# Altium schematic sheet Led7segsheet.SchDoc
size A
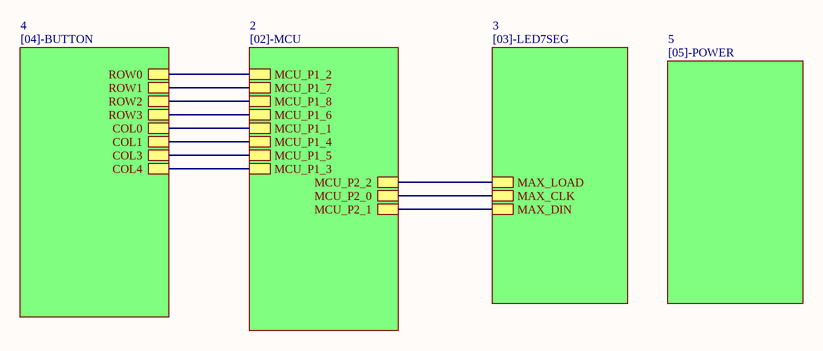
[diagram p0: Led7segsheet.SchDoc]

## Sub-sheets
2 = [02]-MCU: MCU_P2_2, MCU_P2_0, MCU_P2_1, MCU_P1_2, MCU_P1_7, MCU_P1_8, MCU_P1_6, MCU_P1_1, MCU_P1_4, MCU_P1_5, MCU_P1_3
3 = [03]-LED7SEG: MAX_LOAD, MAX_CLK, MAX_DIN
4 = [04]-BUTTON: ROW2, ROW0, COL4, COL1, ROW1, COL0, COL3, ROW3
5 = [05]-POWER: no entries

## Nets
(unnamed): sheet 4/ROW2, sheet 2/MCU_P1_8
(unnamed): sheet 4/ROW0, sheet 2/MCU_P1_2
(unnamed): sheet 4/COL4, sheet 2/MCU_P1_3
(unnamed): sheet 4/COL1, sheet 2/MCU_P1_4
(unnamed): sheet 4/ROW1, sheet 2/MCU_P1_7
(unnamed): sheet 4/COL0, sheet 2/MCU_P1_1
(unnamed): sheet 4/COL3, sheet 2/MCU_P1_5
(unnamed): sheet 4/ROW3, sheet 2/MCU_P1_6
(unnamed): sheet 3/MAX_LOAD, sheet 2/MCU_P2_2
(unnamed): sheet 3/MAX_CLK, sheet 2/MCU_P2_0
(unnamed): sheet 3/MAX_DIN, sheet 2/MCU_P2_1